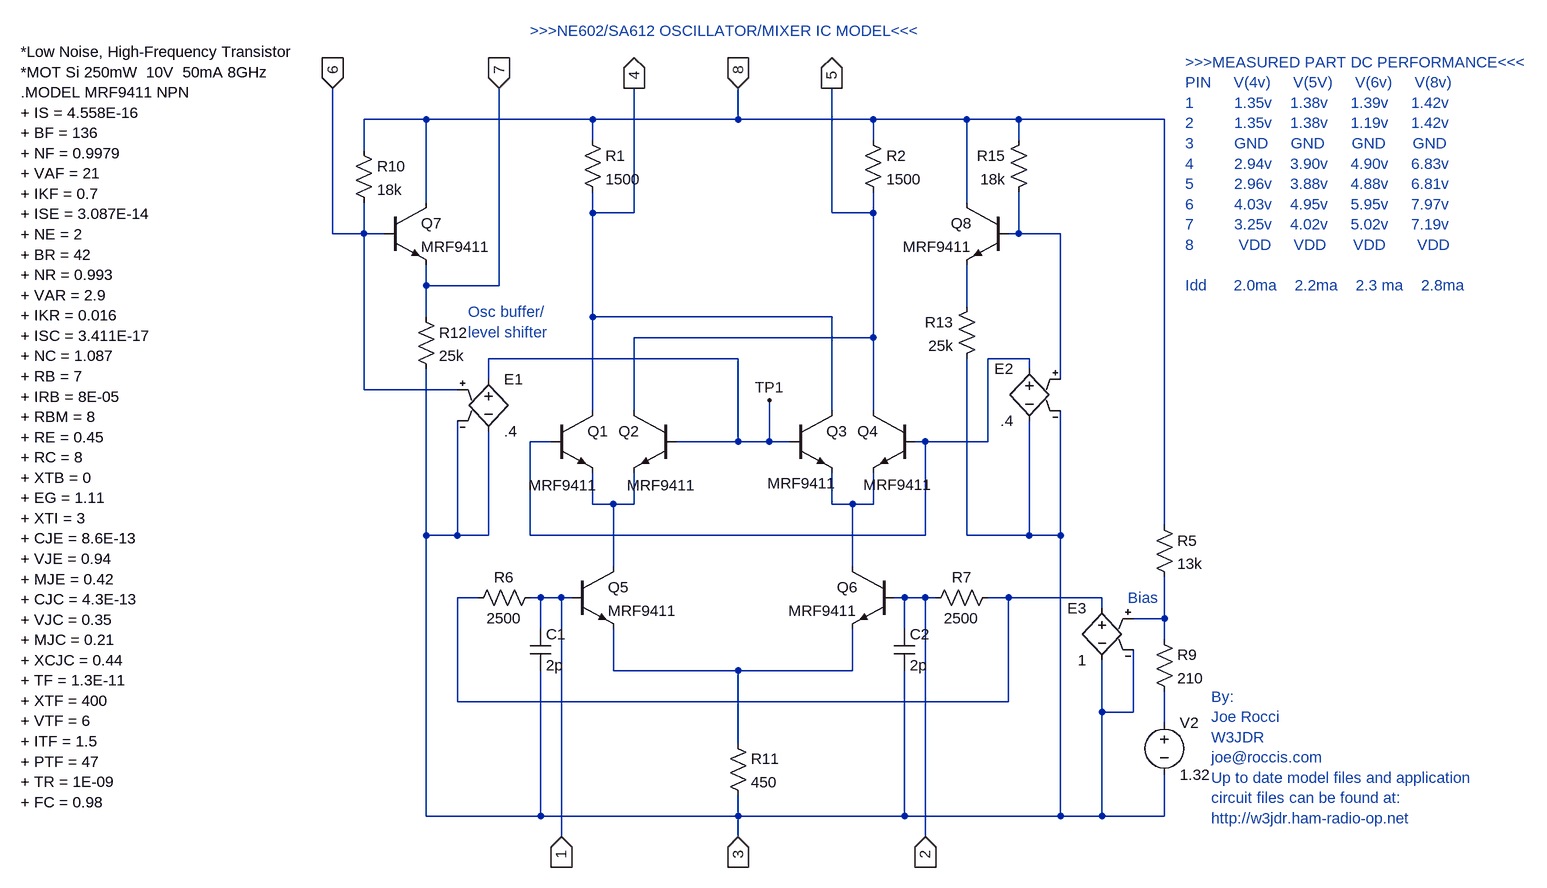
[diagram p0: schematic SA612.asc]
SA612.asc, the LTspice schematic file:
Version 4
SHEET 1 2600 1660
WIRE -688 -560 -784 -560
WIRE -432 -560 -688 -560
WIRE -208 -560 -208 -608
WIRE -208 -560 -432 -560
WIRE 0 -560 -208 -560
WIRE 144 -560 0 -560
WIRE 224 -560 144 -560
WIRE 448 -560 224 -560
WIRE -432 -528 -432 -560
WIRE 0 -528 0 -560
WIRE 224 -528 224 -560
WIRE -784 -512 -784 -560
WIRE -688 -432 -688 -560
WIRE 144 -432 144 -560
WIRE -432 -416 -432 -448
WIRE -368 -416 -368 -608
WIRE -368 -416 -432 -416
WIRE -64 -416 -64 -608
WIRE 0 -416 0 -448
WIRE 0 -416 -64 -416
WIRE -832 -384 -832 -608
WIRE -784 -384 -784 -432
WIRE -784 -384 -832 -384
WIRE -752 -384 -784 -384
WIRE 224 -384 224 -448
WIRE 224 -384 208 -384
WIRE 288 -384 224 -384
WIRE -688 -304 -688 -336
WIRE -576 -304 -576 -608
WIRE -576 -304 -688 -304
WIRE 144 -272 144 -336
WIRE -688 -256 -688 -304
WIRE -432 -256 -432 -416
WIRE -64 -256 -432 -256
WIRE 0 -224 0 -416
WIRE 0 -224 -368 -224
WIRE -208 -192 -592 -192
WIRE 240 -192 176 -192
WIRE 240 -176 240 -192
WIRE -592 -160 -592 -192
WIRE 288 -160 288 -384
WIRE -784 -144 -784 -384
WIRE -640 -144 -784 -144
WIRE -432 -112 -432 -256
WIRE -368 -112 -368 -224
WIRE -64 -112 -64 -256
WIRE 0 -112 0 -224
WIRE -496 -64 -528 -64
WIRE -208 -64 -208 -192
WIRE -208 -64 -304 -64
WIRE -160 -64 -160 -128
WIRE -160 -64 -208 -64
WIRE -128 -64 -160 -64
WIRE 80 -64 64 -64
WIRE 176 -64 176 -192
WIRE 176 -64 80 -64
WIRE -432 32 -432 -16
WIRE -400 32 -432 32
WIRE -368 32 -368 -16
WIRE -368 32 -400 32
WIRE -64 32 -64 -16
WIRE -32 32 -64 32
WIRE 0 32 0 -16
WIRE 0 32 -32 32
WIRE 448 64 448 -560
WIRE -688 80 -688 -176
WIRE -640 80 -640 -96
WIRE -640 80 -688 80
WIRE -592 80 -592 -80
WIRE -592 80 -640 80
WIRE -528 80 -528 -64
WIRE 80 80 80 -64
WIRE 80 80 -528 80
WIRE 144 80 144 -192
WIRE 240 80 240 -96
WIRE 240 80 144 80
WIRE 288 80 288 -112
WIRE 288 80 240 80
WIRE -400 128 -400 32
WIRE -32 128 -32 32
WIRE -608 176 -640 176
WIRE -512 176 -528 176
WIRE -480 176 -512 176
WIRE -464 176 -480 176
WIRE 48 176 32 176
WIRE 80 176 48 176
WIRE 96 176 80 176
WIRE 208 176 176 176
WIRE 352 176 208 176
WIRE 352 192 352 176
WIRE 448 208 448 144
WIRE 448 208 400 208
WIRE -512 224 -512 176
WIRE 48 224 48 176
WIRE 448 240 448 208
WIRE -400 288 -400 224
WIRE -208 288 -400 288
WIRE -32 288 -32 224
WIRE -32 288 -208 288
WIRE -640 336 -640 176
WIRE 208 336 208 176
WIRE 208 336 -640 336
WIRE 352 352 352 272
WIRE 400 352 400 256
WIRE 400 352 352 352
WIRE 448 368 448 320
WIRE -208 400 -208 288
WIRE -688 512 -688 80
WIRE -512 512 -512 288
WIRE -512 512 -688 512
WIRE -208 512 -208 480
WIRE -208 512 -512 512
WIRE 48 512 48 288
WIRE 48 512 -208 512
WIRE 288 512 288 80
WIRE 288 512 48 512
WIRE 352 512 352 352
WIRE 352 512 288 512
WIRE 448 512 448 448
WIRE 448 512 352 512
WIRE -480 544 -480 176
WIRE -208 544 -208 512
WIRE 80 544 80 176
FLAG -64 -608 5
IOPIN -64 -608 Out
FLAG -368 -608 4
IOPIN -368 -608 Out
FLAG -208 -608 8
IOPIN -208 -608 In
FLAG -832 -608 6
IOPIN -832 -608 In
FLAG -576 -608 7
IOPIN -576 -608 In
FLAG 80 544 2
IOPIN 80 544 In
FLAG -480 544 1
IOPIN -480 544 In
FLAG -208 544 3
IOPIN -208 544 In
FLAG -160 -128 TP1
SYMBOL npn -464 128 R0
SYMATTR InstName Q5
SYMATTR Value MRF9411
SYMBOL res -448 -544 R0
SYMATTR InstName R1
SYMATTR Value 1500
SYMBOL res -16 -544 R0
SYMATTR InstName R2
SYMATTR Value 1500
SYMBOL res -512 160 R90
WINDOW 0 0 56 VBottom 0
WINDOW 3 32 56 VTop 0
SYMATTR InstName R6
SYMATTR Value 2500
SYMBOL res 192 160 R90
WINDOW 0 0 56 VBottom 0
WINDOW 3 32 56 VTop 0
SYMATTR InstName R7
SYMATTR Value 2500
SYMBOL res -224 384 R0
SYMATTR InstName R11
SYMATTR Value 450
SYMBOL res -704 -272 R0
SYMATTR InstName R12
SYMATTR Value 25k
SYMBOL res 432 224 R0
SYMATTR InstName R9
SYMATTR Value 210
SYMBOL voltage 448 352 R0
WINDOW 123 0 0 Left 0
WINDOW 39 0 0 Left 0
SYMATTR InstName V2
SYMATTR Value 1.32
SYMBOL res 432 48 R0
SYMATTR InstName R5
SYMATTR Value 13k
SYMBOL res -800 -528 R0
SYMATTR InstName R10
SYMATTR Value 18k
SYMBOL res 160 -288 M0
SYMATTR InstName R13
SYMATTR Value 25k
SYMBOL res 240 -544 M0
SYMATTR InstName R15
SYMATTR Value 18k
SYMBOL e -592 -176 R0
SYMATTR InstName E1
SYMATTR Value .4
SYMBOL e 240 -192 M0
SYMATTR InstName E2
SYMATTR Value .4
SYMBOL npn -496 -112 R0
WINDOW 3 117 115 Left 0
SYMATTR Value MRF9411
SYMATTR InstName Q1
SYMBOL npn -128 -112 R0
WINDOW 3 113 114 Left 0
SYMATTR Value MRF9411
SYMATTR InstName Q3
SYMBOL npn -752 -432 R0
SYMATTR InstName Q7
SYMATTR Value MRF9411
SYMBOL npn -304 -112 M0
WINDOW 3 120 115 Left 0
SYMATTR Value MRF9411
SYMATTR InstName Q2
SYMBOL npn 64 -112 M0
WINDOW 3 120 112 Left 0
SYMATTR Value MRF9411
SYMATTR InstName Q4
SYMBOL npn 32 128 M0
SYMATTR InstName Q6
SYMATTR Value MRF9411
SYMBOL npn 208 -432 M0
SYMATTR InstName Q8
SYMATTR Value MRF9411
SYMBOL e 352 176 M0
SYMATTR InstName E3
SYMATTR Value 1
SYMBOL cap -528 224 R0
SYMATTR InstName C1
SYMATTR Value 2p
SYMBOL cap 32 224 R0
SYMATTR InstName C2
SYMATTR Value 2p
TEXT 392 176 Left 0 ;Bias
TEXT -624 -264 Left 0 ;Osc buffer/\nlevel shifter
TEXT -1312 -664 Left 0 !*Low Noise, High-Frequency Transistor\n*MOT Si 250mW  10V  50mA 8GHz \n.MODEL MRF9411 NPN \n+ IS = 4.558E-16 \n+ BF = 136 \n+ NF = 0.9979 \n+ VAF = 21 \n+ IKF = 0.7 \n+ ISE = 3.087E-14 \n+ NE = 2 \n+ BR = 42 \n+ NR = 0.993 \n+ VAR = 2.9 \n+ IKR = 0.016 \n+ ISC = 3.411E-17 \n+ NC = 1.087 \n+ RB = 7 \n+ IRB = 8E-05 \n+ RBM = 8 \n+ RE = 0.45 \n+ RC = 8 \n+ XTB = 0 \n+ EG = 1.11 \n+ XTI = 3 \n+ CJE = 8.6E-13 \n+ VJE = 0.94 \n+ MJE = 0.42 \n+ CJC = 4.3E-13 \n+ VJC = 0.35 \n+ MJC = 0.21 \n+ XCJC = 0.44 \n+ TF = 1.3E-11 \n+ XTF = 400 \n+ VTF = 6 \n+ ITF = 1.5 \n+ PTF = 47 \n+ TR = 1E-09 \n+ FC = 0.98
TEXT 480 -648 Left 0 ;>>>MEASURED PART DC PERFORMANCE<<<\nPIN     V(4v)     V(5V)     V(6v)     V(8v)\n1         1.35v    1.38v     1.39v     1.42v\n2         1.35v    1.38v     1.19v     1.42v\n3         GND     GND      GND      GND\n4         2.94v    3.90v     4.90v     6.83v \n5         2.96v    3.88v     4.88v     6.81v\n6         4.03v    4.95v     5.95v     7.97v\n7         3.25v    4.02v     5.02v     7.19v\n8          VDD     VDD      VDD       VDD\n \nIdd      2.0ma    2.2ma    2.3 ma    2.8ma
TEXT 520 328 Left 0 ;By:\nJoe Rocci\nW3JDR\njoe@roccis.com\nUp to date model files and application\ncircuit files can be found at:\nhttp://w3jdr.ham-radio-op.net
TEXT -528 -696 Left 0 ;>>>NE602/SA612 OSCILLATOR/MIXER IC MODEL<<<

The netlist it stands for:
* SA612.asc
Q5 N004 1 N008 0 MRF9411
R1 8 4 1500
R2 8 5 1500
R6 1 N006 2500
R7 N006 2 2500
R11 N008 3 450
R12 7 3 25k
R9 N007 N009 210
V2 N009 3 1.32
R5 8 N007 13k
R10 8 6 18k
R13 N002 3 25k
R15 8 N001 18k
E1 TP1 3 6 3 .4
E2 N003 3 N001 3 .4
Q1 4 N003 N004 0 MRF9411
Q3 4 TP1 N005 0 MRF9411
Q7 8 6 7 0 MRF9411
Q2 5 TP1 N004 0 MRF9411
Q4 5 N003 N005 0 MRF9411
Q6 N005 2 N008 0 MRF9411
Q8 8 N001 N002 0 MRF9411
E3 N006 3 N007 3 1
C1 1 3 2p
C2 2 3 2p
.model NPN NPN
.model PNP PNP
.lib standard.bjt
* Bias
* Osc buffer/
* level shifter
*Low Noise, High-Frequency Transistor
*MOT Si 250mW  10V  50mA 8GHz
.MODEL MRF9411 NPN
+ IS = 4.558E-16
+ BF = 136
+ NF = 0.9979
+ VAF = 21
+ IKF = 0.7
+ ISE = 3.087E-14
+ NE = 2
+ BR = 42
+ NR = 0.993
+ VAR = 2.9
+ IKR = 0.016
+ ISC = 3.411E-17
+ NC = 1.087
+ RB = 7
+ IRB = 8E-05
+ RBM = 8
+ RE = 0.45
+ RC = 8
+ XTB = 0
+ EG = 1.11
+ XTI = 3
+ CJE = 8.6E-13
+ VJE = 0.94
+ MJE = 0.42
+ CJC = 4.3E-13
+ VJC = 0.35
+ MJC = 0.21
+ XCJC = 0.44
+ TF = 1.3E-11
+ XTF = 400
+ VTF = 6
+ ITF = 1.5
+ PTF = 47
+ TR = 1E-09
+ FC = 0.98
* >>>MEASURED PART DC PERFORMANCE<<<
* PIN     V(4v)     V(5V)     V(6v)     V(8v)
* 1         1.35v    1.38v     1.39v     1.42v
* 2         1.35v    1.38v     1.19v     1.42v
* 3         GND     GND      GND      GND
* 4         2.94v    3.90v     4.90v     6.83v
* 5         2.96v    3.88v     4.88v     6.81v
* 6         4.03v    4.95v     5.95v     7.97v
* 7         3.25v    4.02v     5.02v     7.19v
* 8          VDD     VDD      VDD       VDD
* Idd      2.0ma    2.2ma    2.3 ma    2.8ma
* By:
* Joe Rocci
* W3JDR
* joe@roccis.com
* Up to date model files and application
* circuit files can be found at:
* http://w3jdr.ham-radio-op.net
* >>>NE602/SA612 OSCILLATOR/MIXER IC MODEL<<<
.backanno
.end